# EAGLE design Riego_Auto_V1.0 (EAGLE 6.6.0)
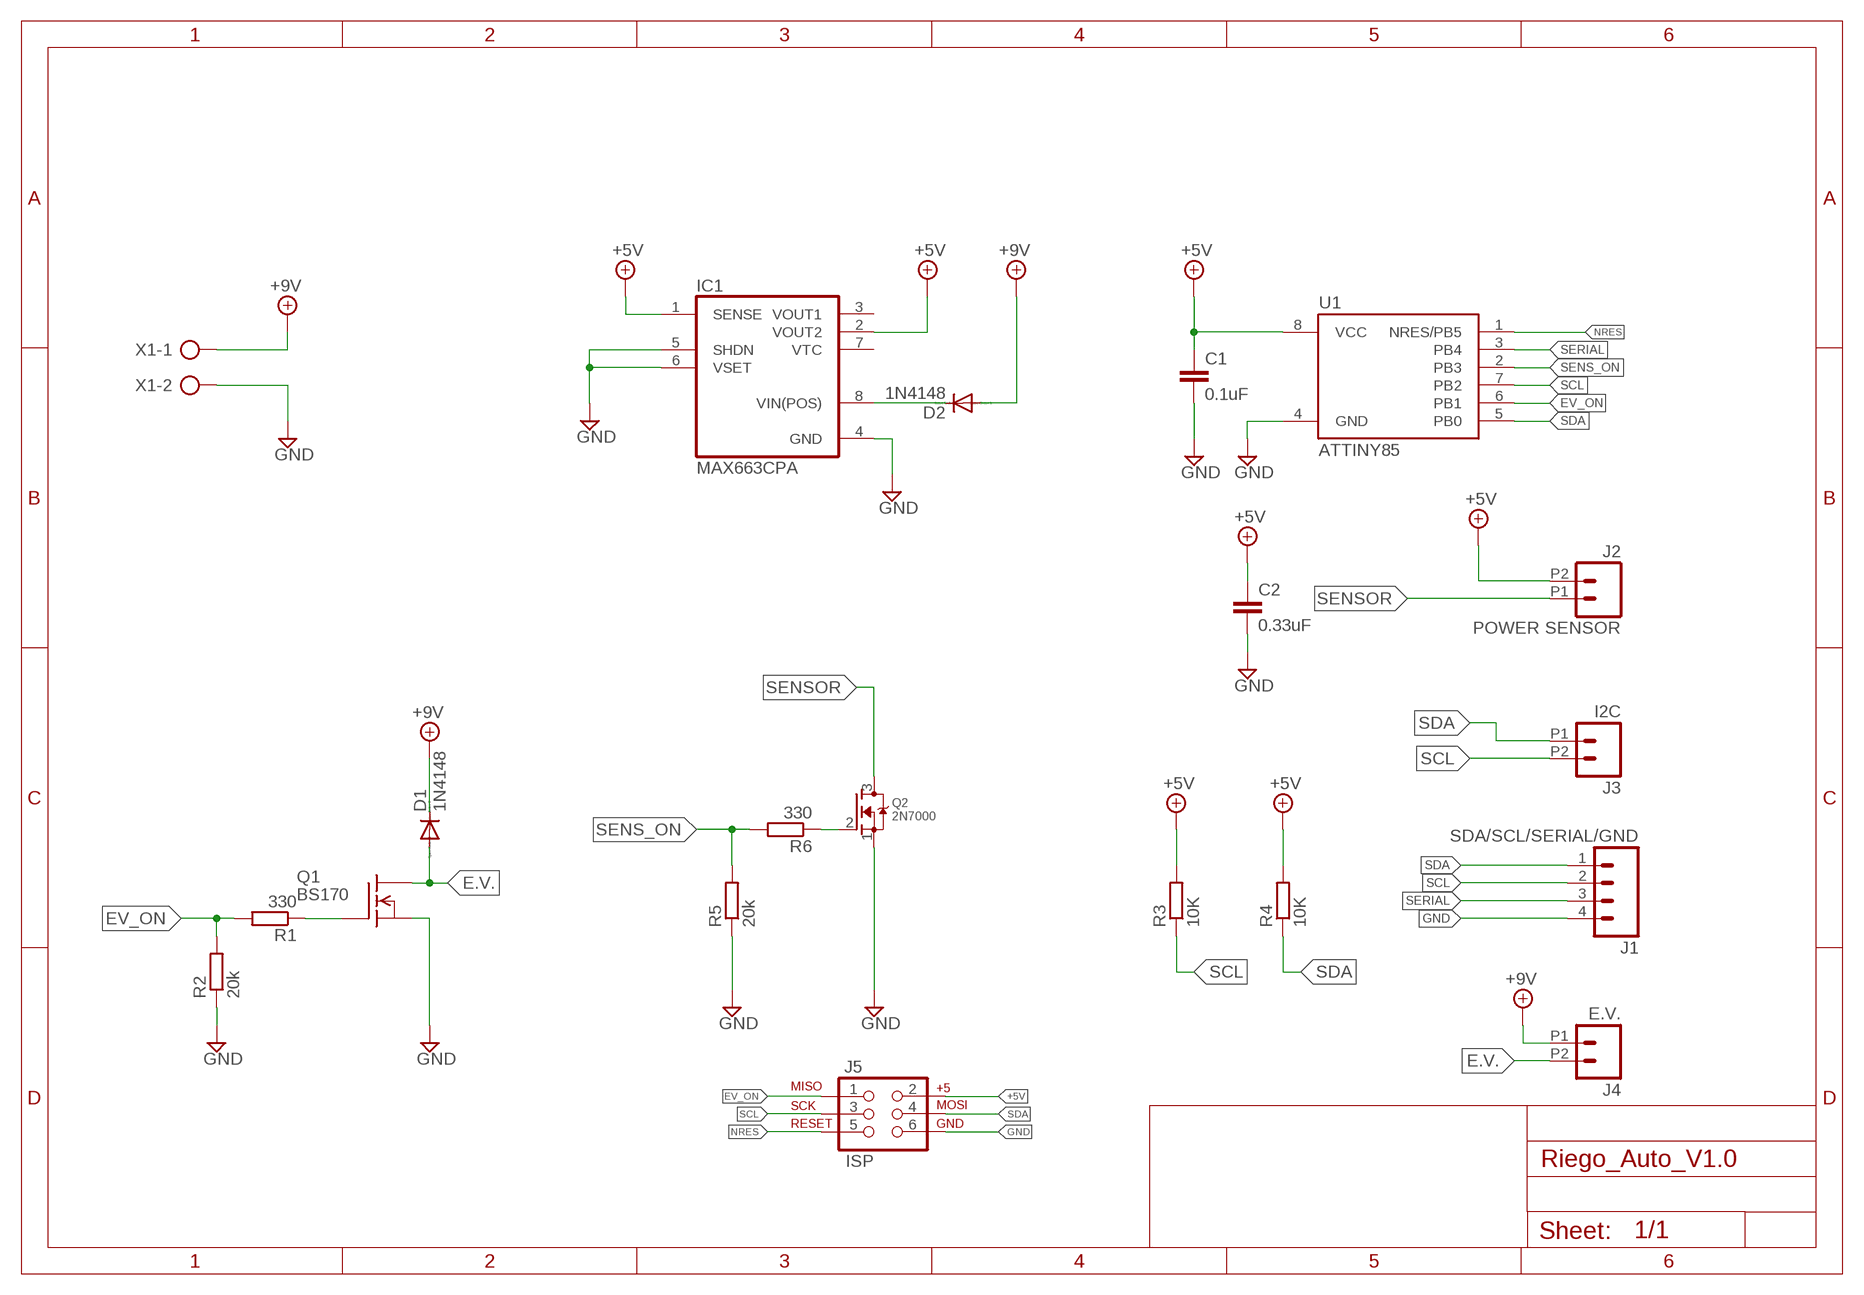
[diagram p0: schematic, sheet 1]

## Parts
C1  0.1uF  C-EU050-025X075  [C050-025X075]
C2  0.33uF  C-EU050-024X044  [C050-024X044]
D1  1N4148  1N4148DO35-7  [DO35-7]
D2  1N4148  1N4148DO35-7  [DO35-7]
IC1  MAX663CPA  [DIL08]
J1  SDA/SCL/SERIAL/GND  M04PTH  [1X04]
J2  POWER SENSOR  M022.54MM_SCREWTERM  [1X02_2.54_SCREWTERM]
J3  I2C  M022.54MM_SCREWTERM  [1X02_2.54_SCREWTERM]
J4  E.V.  M022.54MM_SCREWTERM  [1X02_2.54_SCREWTERM]
J5  ISP  AVR_SPI_PRG_6PTH  [2X3]
Q1  BS170  FQN1N50CI  [TO92-INLINE]
Q2  2N7000  MOSFET-N  [TO92-INLINE]
R1  330  R-EU_0204/7  [0204/7]
R2  20k  R-EU_0204/7  [0204/7]
R3  10K  R-EU_0204/7  [0204/7]
R4  10K  R-EU_0204/7  [0204/7]
R5  20k  R-EU_0204/7  [0204/7]
R6  330  R-EU_0204/7  [0204/7]
U1  ATTINY85  ATTINY85DIL  [DIL08]
X1  AK500/2  [AK500/2]

## Nets
+5V: C1.1 C2.1 IC1.1(SENSE) IC1.2(VOUT2) J2.P2 J5.2 R3.2 R4.2 U1.8(VCC)
+12V: D1.C D2.A J4.P1 X1.1 ; supply symbol labelled +9V
E.V.: D1.A J4.P2 Q1.1(D)
EV_ON: J5.1 R1.2 R2.2 U1.6(PB1)
GND: C1.2 C2.2 IC1.4(GND) IC1.5(SHDN) IC1.6(VSET) J1.4 J5.6 Q1.3(S) Q2.1(S) R2.1 R5.1 U1.4(GND) X1.2
N$1: Q1.2(G) R1.1
N$2: D2.C IC1.8(VIN(POS))
N$3: Q2.2(G) R6.1
NRES: J5.5 U1.1(NRES/PB5)
SCL: J1.2 J3.P2 J5.3 R3.1 U1.7(PB2)
SDA: J1.1 J3.P1 J5.4 R4.1 U1.5(PB0)
SENS_ON: R5.2 R6.2 U1.2(PB3)
SENSOR: J2.P1 Q2.3(D)
SERIAL: J1.3 U1.3(PB4)
Unconnected: IC1.3(VOUT1) IC1.7(VTC)

## Library data of the parts
C1 C2 = rcl:C-EU: CAPACITOR, European symbol
D1 D2 = diode:1N4148: DIODE high speed (Philips)
IC1 = maxim:MAX663CPA: Positive VOLTAGE REGULATOR; MPN: MAX663CPA+; OC_FARNELL: unknown; OC_NEWARK: 03M8949
J1 = SparkFun-Connectors:M04: Header 4 Standard 4-pin 0.1" header. Use with straight break away headers (SKU : PRT-00116), right angle break away headers (PRT-00553), swiss pins (PRT-00743), machine pins (PRT-00117), and female headers (PRT-00115). Molex polarized connector foot print use with SKU : PRT-08231 with associated crimp pins and housings. 1MM SMD Version SKU: PRT-10208; PROD_ID: CONN-09696
J2-J4 = SparkFun-Connectors:M02: Standard 2-pin 0.1" header. Use with - straight break away headers ( PRT-00116) - right angle break away headers (PRT-00553) - swiss pins (PRT-00743) - machine pins (PRT-00117) - female headers (PRT-00115) Molex polarized connector foot print use with: PRT-08233 with associated crimp pins and housings. 2.54_SCREWTERM for use with PRT-10571. 3.5mm Screw Terminal footprints for PRT-08084 5mm Screw Terminal footprints for use with PRT-08432
J5 = SparkFun-Connectors:AVR_SPI_PRG_6: AVR ISP 6 Pin This is the reduced ISP connector for AVR programming. Common on Arduino. This footprint will take up less PCB space and can be used with a 10-pin to 6-pin adapter such as SKU: BOB-08508 **Special note about "TEST_POINT" package. The stop mask is on the top side, so if you want your programming test points to be on the bottom of your board, make sure to place this package on the bottom side of the board. This also ensure that the orientation to program from the bottom side will be correct.
Q1 = adafruit:FQN1N50C: N-Channel Enhancement MOSFET 500V, 0.4A, 6.0 Ohm
Q2 = Mi_libreria:MOSFET-N: N-Channel Mosfet 2N7000 - 60V 200mA TO-92
R1-R6 = resistor:R-EU_: RESISTOR, European symbol
U1 = attiny85:ATTINY85: ATMEL ATtiny 85
X1 = con-ptr500:AK500/2: CONNECTOR; OC_FARNELL: unknown; OC_NEWARK: unknown

## Board
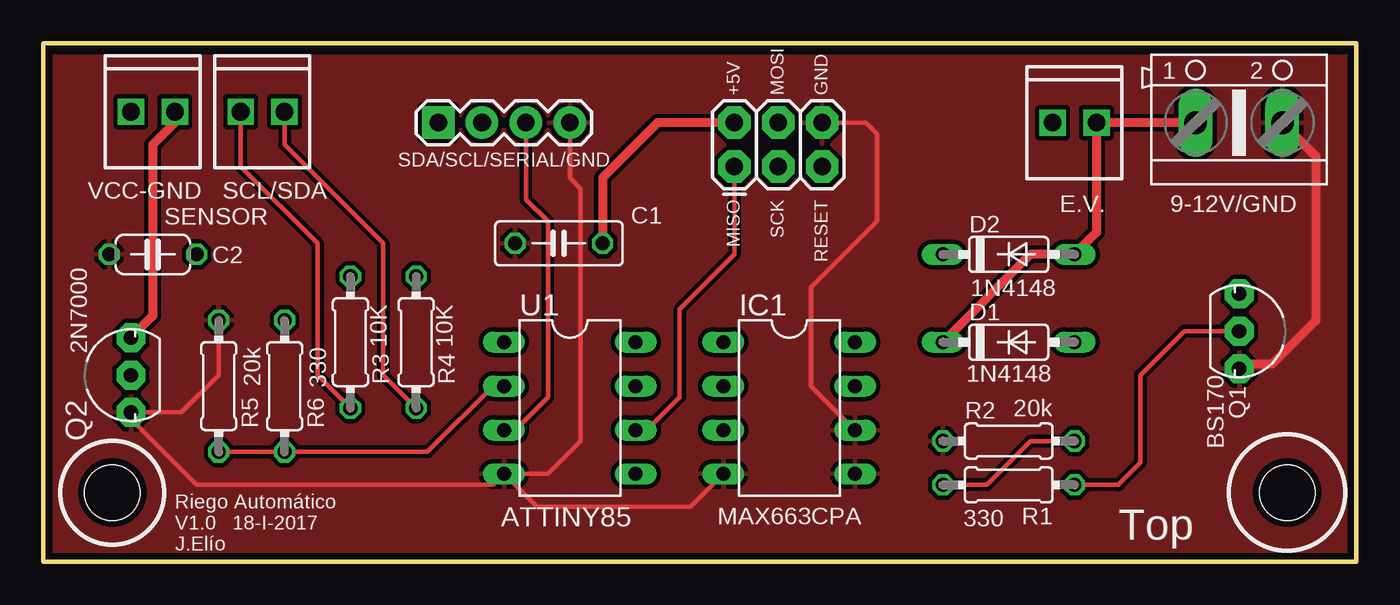
[diagram p1: board, top side]
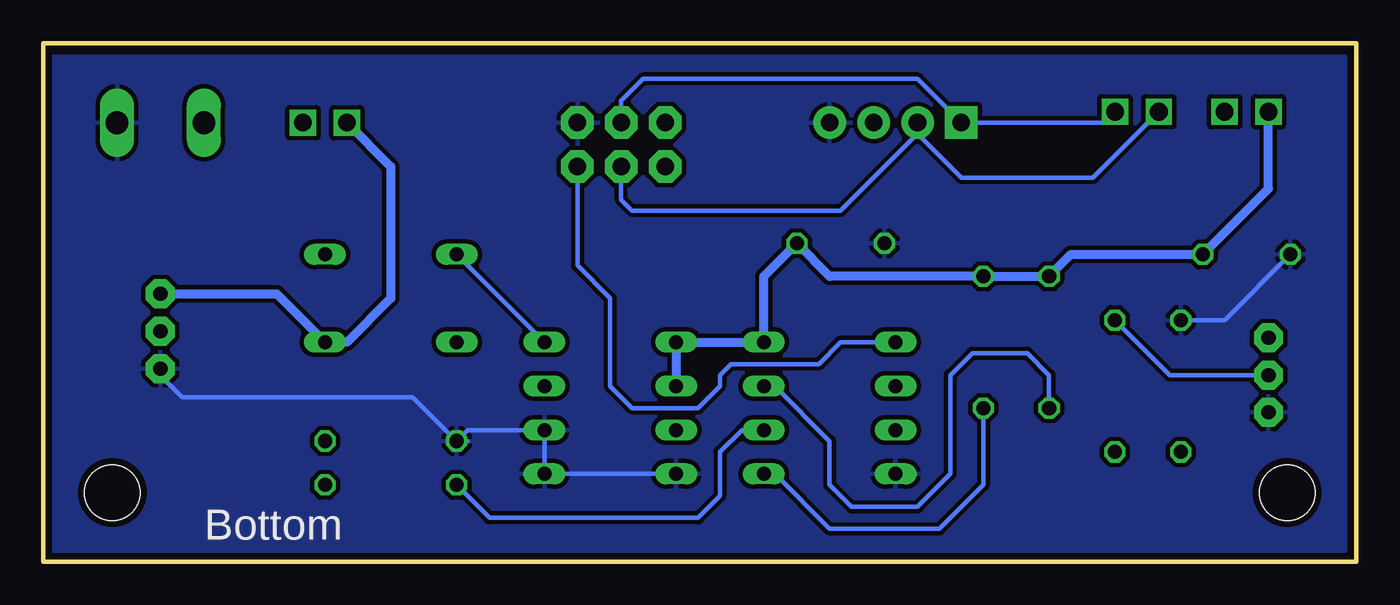
[diagram p2: board, bottom side, seen from below]

Size 76 x 30 mm. Coordinates in mm from the lower left corner, seen from the top.
Outline: 0,0 76,0 76,30 0,30 0,0
Copper layers (1*16): Top 0.0356mm / dielectric 1.5011mm / Bottom 0.0356mm
Design rules "oshpark-2layer": minimum track width 6mil, minimum drill 13mil, track to track 6mil, track to pad 6mil, pad to pad 6mil, via to via 6mil, smd to smd 6mil, copper to edge 15mil, drill to drill 6mil, minimum pad ring 7mil, minimum via ring 7mil, stop-mask expansion 2.5mil, vias tented up to drill 0mil, thermal gap 10mil
Holes 3.2 mm at 4,4 72,4

### Footprints (pad centres in the part's own frame; a part is rotated, then mirrored left to right if it is on the bottom)
C050-025X075 = drill 0.813 octagon: 1 -2.54,0; 2 2.54,0
C050-024X044 = drill 0.813 octagon: 1 -2.54,0; 2 2.54,0
DO35-7 = drill 0.813 long: A 3.81,0; C -3.81,0
DIL08 = drill 0.813 long: 1 -3.81,-3.81; 2 -1.27,-3.81; 3 1.27,-3.81; 4 3.81,-3.81; 5 3.81,3.81; 6 1.27,3.81; 7 -1.27,3.81; 8 -3.81,3.81
1X04 = drill 1.016 pad 1.88 square: 1 0,0 | drill 1.016 pad 1.88: 2 2.54,0; 3 5.08,0; 4 7.62,0
1X02_2.54_SCREWTERM = drill 1.016 square: P1 2.54,0; P2 0,0
2X3 = drill 1.016 pad 1.88 octagon: 1 0,0; 2 0,2.54; 3 2.54,0; 4 2.54,2.54; 5 5.08,0; 6 5.08,2.54
TO92-INLINE = drill 0.813 pad 1.676 octagon: 1 -2.159,0; 2 0,0; 3 2.159,0
0204/7 = drill 0.813 octagon: 1 -3.81,0; 2 3.81,0
AK500/2 = drill 1.321 long: 1 -2.515,0; 2 2.515,0

### Placement (x,y rotation side)
C1  29.84,18.41 180 top
C2  6.35,17.78 180 top
D1  55.88,12.7 0 top
D2  55.88,17.78 0 top
IC1  43.18,8.89 270 top
J1  22.86,25.4 0 top
J2  5.08,26.04 0 top
J3  11.43,26.04 0 top
J4  58.42,25.4 0 top
J5  40.01,22.86 0 top
Q1  69.22,13.34 270 top
Q2  5.08,10.79 90 top
R1  55.88,4.45 180 top
R2  55.88,6.99 0 top
R3  17.78,12.7 90 top
R4  21.59,12.7 90 top
R5  10.16,10.16 270 top
R6  13.97,10.16 270 top
U1  30.48,8.89 270 top
X1  69.22,25.4 0 top

### Tracks (layer width: path | path; a pad name or v marks a point on that pad's centre or on a via)
+5V
  Top 0.508: J5.2 35.56,25.4 32.38,22.23 C1.1
  Bottom 0.508: IC1.2 IC1.1 U1.8 34.29,16.51 C1.1 30.48,16.51 R4.2 R3.2 16.51,17.78 C2.1 5.08,21.59 J2.P2
+12V
  Top 0.508: X1.1 J4.P1 60.96,19.05 D2.A 57.15,17.78 D1.C
E.V.
  Bottom 0.508: Q1.1 62.48,15.49 D1.A 58.42,12.7 55.88,15.24 55.88,22.86 J4.P2
EV_ON
  Top 0.254: R2.2 57.15,6.99 54.61,4.45 R1.2 | J5.1 40.01,17.78 36.83,14.61 36.83,9.53 34.92,7.62 U1.6
  Bottom 0.254: U1.6 35.56,7.62 36.83,6.35 36.83,3.81 38.1,2.54 50.16,2.54 R1.2
GND
  Top 0.254: J5.6 47.62,25.4 48.26,24.77 48.26,19.68 44.45,15.88 44.45,10.16 IC1.6 | IC1.4 37.47,3.17 28.57,3.17 U1.4 | J1.4 30.48,22.23 31.11,21.59 31.11,6.99 29.21,5.08 U1.4 | U1.4 26.04,4.45 8.89,4.45 5.08,8.26 Q2.1 8,8.64 10.16,10.79 R5.1
  Top 0.508: X1.2 73.66,23.47 73.66,13.97 71.12,11.43 69.47,11.43 Q1.3
  Bottom 0.254: IC1.4 IC1.5 IC1.6 51.44,7.62 R2.1 | R2.1 54.61,9.53 67.94,9.53 69.22,10.79 Q1.3 | R2.1 51.44,6.99 | R5.1 7.62,13.97 C2.2
  pour Bottom (isolate 0.254): 0.64,0.64 75.56,0.64 75.56,29.21 0.64,29.21
  pour Top (isolate 0.254): 0.64,0.64 75.56,0.64 75.56,29.21 0.64,29.21
N$1
  Top 0.254: Q1.2 66.04,13.34 63.5,10.79 63.5,5.71 62.23,4.45 R1.1
N$2
  Bottom 0.254: IC1.8 D2.C
N$3
  Bottom 0.254: Q2.2 10.79,10.79 R6.1
NRES
  Bottom 0.254: J5.5 45.09,17.14 43.18,15.24 43.18,10.16 41.91,8.89 38.1,8.89 36.83,10.16 36.83,10.79 36.2,11.43 31.11,11.43 29.84,12.7 U1.1
SCL
  Top 0.254: J3.P2 11.43,22.86 15.88,18.41 15.88,10.79 R3.1
  Bottom 0.254: J3.P2 15.24,22.23 22.86,22.23 25.4,24.77 | J5.3 42.55,20.95 41.91,20.32 29.84,20.32 25.4,24.77 | 25.4,24.77 J1.2 | U1.7 33.66,10.16 30.48,6.99 30.48,4.45 29.21,3.17 25.4,3.17 23.5,5.08 23.5,10.79 22.23,12.06 19.05,12.06 17.78,10.79 R3.1
SDA
  Top 0.254: J3.P1 13.97,24.13 19.68,18.41 19.68,10.79 R4.1
  Bottom 0.254: J3.P1 14.61,25.4 J1.1 25.4,27.94 41.27,27.94 42.55,26.67 J5.4 | U1.5 33.66,5.08 30.48,1.91 24.13,1.91 21.59,4.45 R4.1
SENS_ON
  Top 0.254: U1.2 26.04,10.16 22.23,6.35 R6.2 R5.2
SENSOR
  Top 0.508: J2.P1 7.62,25.4 6.35,24.13 6.35,14.22 Q2.3
SERIAL
  Top 0.254: J1.3 27.94,20.95 29.21,19.68 29.21,9.53 27.3,7.62 U1.3

### Text on the board
tPlace: Riego Automático / V1.0 18-I-2017 / J.Elío
tNames: +5V | MOSI | GND | VCC-GND | SCL/SDA | MISO | SCK | RESET | SENSOR | E.V. | 9-12V/GND | Top
bNames: Bottom